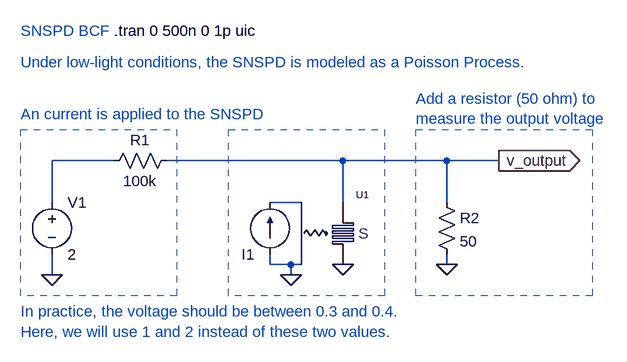
[diagram p0: schematic snspd.asc]
snspd.asc, the LTspice schematic file:
Version 4
SHEET 1 880 680
WIRE -400 -608 -496 -608
WIRE -48 -608 -320 -608
WIRE 112 -608 -48 -608
WIRE 192 -608 112 -608
WIRE -496 -544 -496 -608
WIRE -112 -544 -160 -544
WIRE -48 -544 -48 -608
WIRE 112 -544 112 -608
WIRE -160 -448 -160 -464
WIRE -128 -448 -160 -448
WIRE -112 -448 -128 -448
WIRE 112 -448 112 -464
WIRE -496 -432 -496 -464
WIRE -128 -432 -128 -448
FLAG 112 -448 0
FLAG -48 -448 0
FLAG -128 -432 0
FLAG -496 -432 0
FLAG 192 -608 v_output
IOPIN 192 -608 Out
SYMBOL snspdWithPhotonPort -48 -496 R0
SYMATTR InstName U1
SYMATTR Value Lind=130n
SYMATTR SpiceModel nanowireBCF
SYMBOL res 96 -560 R0
SYMATTR InstName R2
SYMATTR Value 50
SYMBOL current -160 -464 R180
WINDOW 3 -411 -88 Invisible 2
WINDOW 123 0 0 Left 2
WINDOW 39 0 0 Left 2
SYMATTR Value PWL file=D:\GitHub\SNSPDs-Probabilistic-Computing\outputPy\snspd_data.txt
SYMATTR InstName I1
SYMBOL voltage -496 -560 R0
WINDOW 123 0 0 Left 2
SYMATTR InstName V1
SYMATTR Value 2
SYMATTR SpiceLine Rser=0
SYMBOL res -304 -624 R90
WINDOW 0 0 56 VBottom 2
WINDOW 3 32 56 VTop 2
SYMATTR InstName R1
SYMATTR Value 100k
TEXT -400 -808 Left 2 !.tran 0 500n 0 1p uic
TEXT -544 -808 Left 2 ;SNSPD BCF
TEXT 64 -704 Left 2 ;Add a resistor (50 ohm) to\nmeasure the output voltage
TEXT -544 -680 Left 2 ;An current is applied to the SNSPD
TEXT -544 -760 Left 2 ;Under low-light conditions, the SNSPD is modeled as a Poisson Process.
TEXT -544 -376 Left 2 ;In practice, the voltage should be between 0.3 and 0.4.\nHere, we will use 1 and 2 instead of these two values.
RECTANGLE Normal -304 -400 -544 -656 1
RECTANGLE Normal 16 -400 -224 -656 1
RECTANGLE Normal 336 -400 64 -656 1

The netlist it stands for:
* snspd.asc
XU1 N002 0 v_output 0 nanowireBCF Lind=130n  ; pins gate-in photon-out ? ?
R2 v_output 0 50
I1 0 N002 PWL file=D:\GitHub\SNSPDs-Probabilistic-Computing\outputPy\snspd_data.txt
V1 N001 0 2 Rser=0
R1 v_output N001 100k
.tran 0 500n 0 1p uic
* SNSPD BCF
* Add a resistor (50 ohm) to
* measure the output voltage
* An current is applied to the SNSPD
* Under low-light conditions, the SNSPD is modeled as a Poisson Process.
* In practice, the voltage should be between 0.3 and 0.4.
* Here, we will use 1 and 2 instead of these two values.
.lib snspd.lib
.backanno
.end